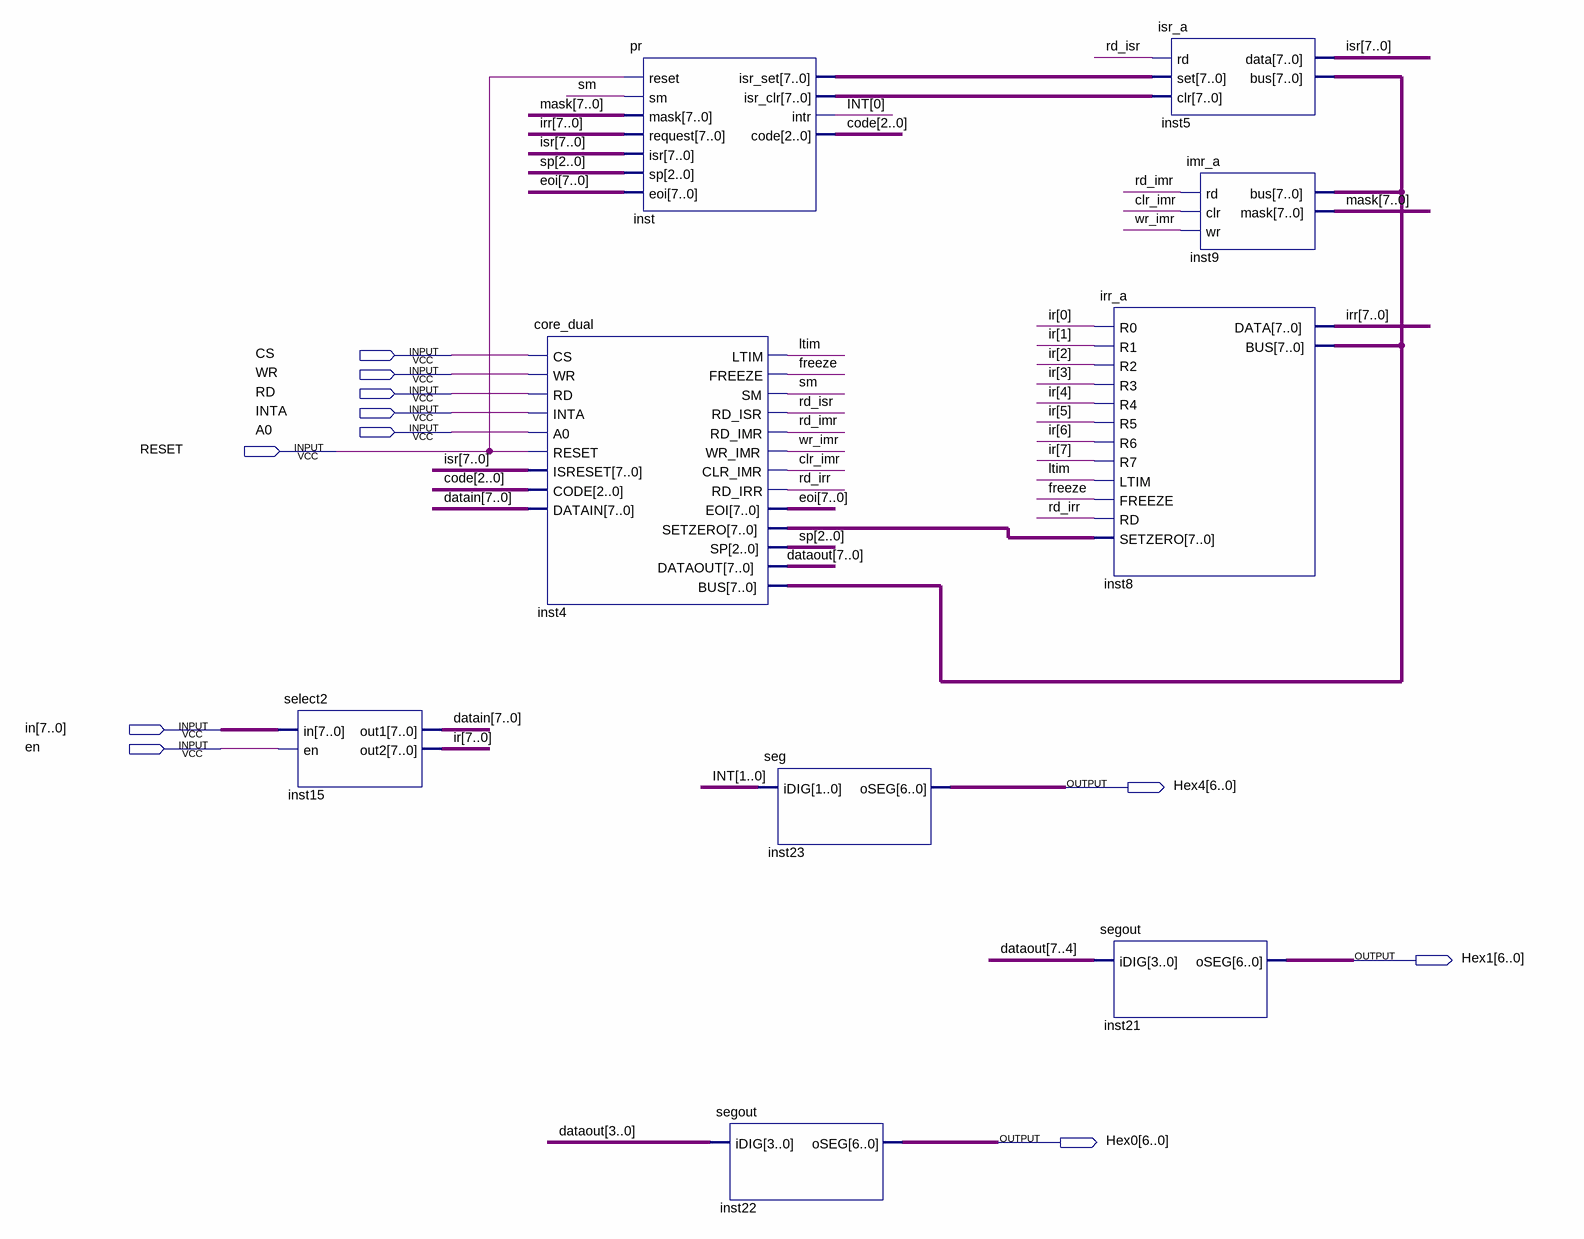
[diagram p0: schematic sheet]
// Quartus schematic 8259a_down.bdf as structural Verilog: 9 symbols, 11 pins
module \8259a_down  (
  input  CS,
  input  WR,
  input  RD,
  input  INTA,
  input  A0,
  input  RESET,
  input  [7:0] in,
  input  en,
  output [6:0] Hex4,
  output [6:0] Hex1,
  output [6:0] Hex0
);

  wire clr_imr, freeze, ltim, rd_imr, rd_irr, rd_isr, sm, wr_imr;
  wire [1:0] INT;
  wire [2:0] code, sp;
  wire [7:0] datain, dataout, eoi, inst4_bus, inst4_setzero, inst_isr_clr, inst_isr_set, ir, irr, isr, mask;

  select2 inst15 (.in(in), .en(en), .out1(datain), .out2(ir));
  core_dual inst4 (
    .CS(CS), .WR(WR), .RD(RD), .INTA(INTA), .A0(A0), .RESET(RESET), .ISRESET(isr), .CODE(code),
    .DATAIN(datain), .LTIM(ltim), .FREEZE(freeze), .SM(sm), .RD_ISR(rd_isr), .RD_IMR(rd_imr),
    .WR_IMR(wr_imr), .CLR_IMR(clr_imr), .RD_IRR(rd_irr), .EOI(eoi), .SETZERO(inst4_setzero), .SP(sp),
    .DATAOUT(dataout), .BUS(inst4_bus));
  pr inst (
    .reset(RESET), .sm(sm), .mask(mask), .request(irr), .isr(isr), .sp(sp), .eoi(eoi),
    .isr_set(inst_isr_set), .isr_clr(inst_isr_clr), .intr(INT[0]), .code(code));
  seg inst23 (.iDIG(INT), .oSEG(Hex4));
  segout inst22 (.iDIG(dataout[3:0]), .oSEG(Hex0));
  isr_a inst5 (.rd(rd_isr), .set(inst_isr_set), .clr(inst_isr_clr), .data(isr), .bus(inst4_bus));
  irr_a inst8 (
    .R0(ir[0]), .R1(ir[1]), .R2(ir[2]), .R3(ir[3]), .R4(ir[4]), .R5(ir[5]), .R6(ir[6]), .R7(ir[7]),
    .LTIM(ltim), .FREEZE(freeze), .RD(rd_irr), .SETZERO(inst4_setzero), .DATA(irr), .BUS(inst4_bus));
  segout inst21 (.iDIG(dataout[7:4]), .oSEG(Hex1));
  imr_a inst9 (.rd(rd_imr), .clr(clr_imr), .wr(wr_imr), .mask(mask), .bus(inst4_bus));
endmodule
